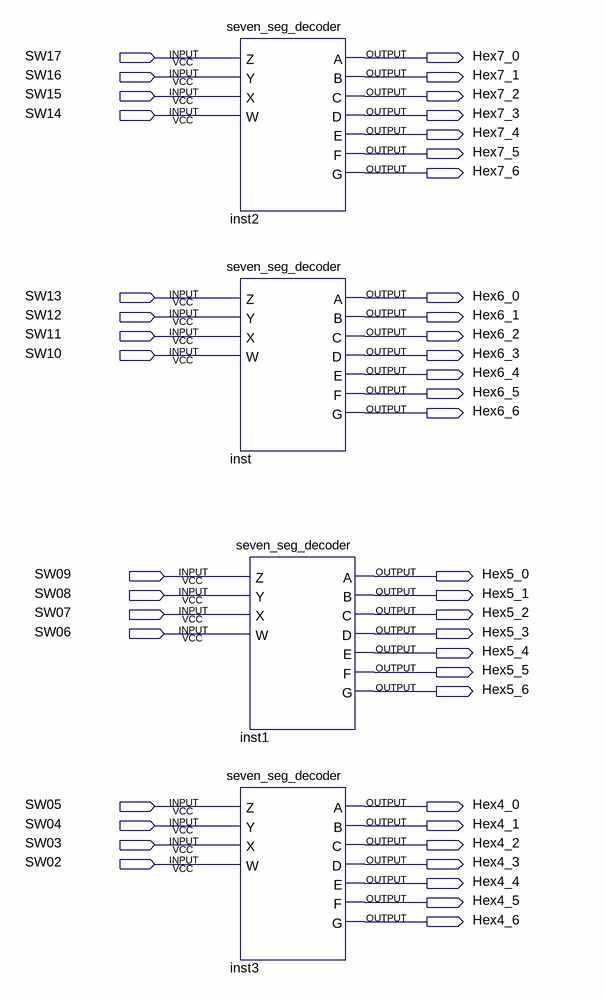
[diagram p0: schematic sheet]
// Quartus schematic lab05step1.bdf as structural Verilog: 4 symbols, 44 pins
module lab05step1 (
  input  SW17,
  input  SW16,
  input  SW15,
  input  SW14,
  input  SW13,
  input  SW12,
  input  SW11,
  input  SW10,
  input  SW09,
  input  SW08,
  input  SW07,
  input  SW06,
  input  SW05,
  input  SW04,
  input  SW03,
  input  SW02,
  output Hex7_0,
  output Hex7_1,
  output Hex7_2,
  output Hex7_3,
  output Hex7_4,
  output Hex7_5,
  output Hex7_6,
  output Hex6_0,
  output Hex6_1,
  output Hex6_2,
  output Hex6_3,
  output Hex6_4,
  output Hex6_5,
  output Hex6_6,
  output Hex5_0,
  output Hex5_1,
  output Hex5_2,
  output Hex5_3,
  output Hex5_4,
  output Hex5_5,
  output Hex5_6,
  output Hex4_0,
  output Hex4_1,
  output Hex4_2,
  output Hex4_3,
  output Hex4_4,
  output Hex4_5,
  output Hex4_6
);

  seven_seg_decoder inst2 (
    .Z(SW17), .Y(SW16), .X(SW15), .W(SW14), .A(Hex7_0), .B(Hex7_1), .C(Hex7_2), .D(Hex7_3), .E(Hex7_4),
    .F(Hex7_5), .G(Hex7_6));
  seven_seg_decoder inst (
    .Z(SW13), .Y(SW12), .X(SW11), .W(SW10), .A(Hex6_0), .B(Hex6_1), .C(Hex6_2), .D(Hex6_3), .E(Hex6_4),
    .F(Hex6_5), .G(Hex6_6));
  seven_seg_decoder inst1 (
    .Z(SW09), .Y(SW08), .X(SW07), .W(SW06), .A(Hex5_0), .B(Hex5_1), .C(Hex5_2), .D(Hex5_3), .E(Hex5_4),
    .F(Hex5_5), .G(Hex5_6));
  seven_seg_decoder inst3 (
    .Z(SW05), .Y(SW04), .X(SW03), .W(SW02), .A(Hex4_0), .B(Hex4_1), .C(Hex4_2), .D(Hex4_3), .E(Hex4_4),
    .F(Hex4_5), .G(Hex4_6));
endmodule
